# Altium schematic sheet Fdbk_2.SchDoc
size A4; SheetNumber: 4; SheetTotal: 5
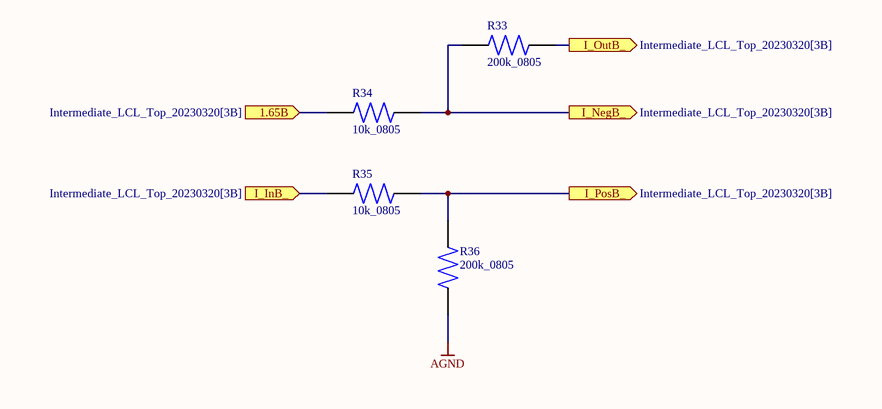
[diagram p0: Fdbk_2.SchDoc]

## Parts
R33  200k_0805  [0805 Resistor]
R34  10k_0805  [0805 Resistor]
R35  10k_0805  [0805 Resistor]
R36  200k_0805  [0805 Resistor]

## Ports
1.65B (in, see Intermediate_LCL_Top_20230320[3B]), I_InB_ (in, see Intermediate_LCL_Top_20230320[3B]), I_NegB_ (out, see Intermediate_LCL_Top_20230320[3B]), I_OutB_ (out, see Intermediate_LCL_Top_20230320[3B]), I_PosB_ (out, see Intermediate_LCL_Top_20230320[3B])

## Nets
AGND: R36.1
1.65B: R34.1 ; port 1.65B
I_InB_: R35.1 ; port I_InB_
I_NegB_: R33.1 R34.2 ; port I_NegB_
I_OutB_: R33.2 ; port I_OutB_
I_PosB_: R35.2 R36.2 ; port I_PosB_

## Library data of the parts
R33 R36 = CRCW0805200KFKEA: SMD Chip Resistor, 200 kohm, ± 1%, 125 mW, 0805 [2012 Metric], Thick Film, General Purpose; MF: Bourns; MP: CRE2512-FZ-R007E-3; Mouser-Purchase-URL: https://snapeda.com/shop?store=Mouser&id=836123; Price: None; Package: 6432 Stackpole; Value: *; SnapEDA_Link: https://www.snapeda.com/parts/CRE2512-FZ-R007E-3/Bourns/view-part/836123/?ref=snap; DigiKey-Purchase-URL: https://snapeda.com/shop?store=DigiKey&id=836123; Availability: Good
R34 R35 = CRCW080510K0FKEA: SMD Chip Resistor, 10 kohm, ± 1%, 125 mW, 0805 [2012 Metric], Thick Film, General Purpose; MF: Bourns; MP: CRE2512-FZ-R007E-3; Mouser-Purchase-URL: https://snapeda.com/shop?store=Mouser&id=836123; Price: None; Package: 6432 Stackpole; Value: *; SnapEDA_Link: https://www.snapeda.com/parts/CRE2512-FZ-R007E-3/Bourns/view-part/836123/?ref=snap; DigiKey-Purchase-URL: https://snapeda.com/shop?store=DigiKey&id=836123; Availability: Good